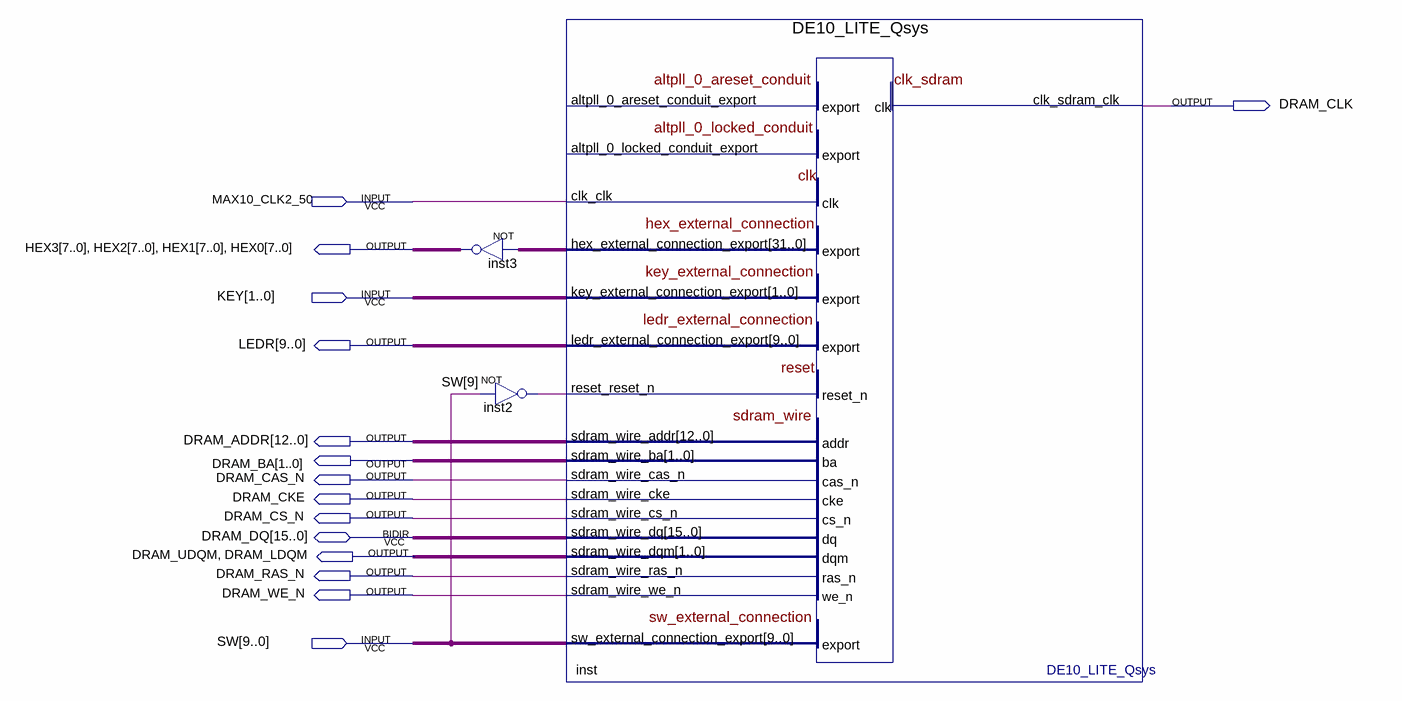
[diagram p0: schematic sheet]
// Quartus schematic DE10_LITE_Nios_0.bdf as structural Verilog: 3 symbols, 15 pins
module DE10_LITE_Nios_0 (
  input  MAX10_CLK2_50,
  input  [1:0] KEY,
  input  [9:0] SW,
  inout  [15:0] DRAM_DQ,
  output DRAM_CLK,
  output [7:0] HEX3,
  output [7:0] HEX2,
  output [7:0] HEX1,
  output [7:0] HEX0,
  output [9:0] LEDR,
  output [12:0] DRAM_ADDR,
  output [1:0] DRAM_BA,
  output DRAM_CAS_N,
  output DRAM_CKE,
  output DRAM_CS_N,
  output DRAM_UDQM,
  output DRAM_LDQM,
  output DRAM_RAS_N,
  output DRAM_WE_N
);

  wire inst2_out;
  wire [31:0] inst_hex_external_connection_export;

  assign {HEX3, HEX2, HEX1, HEX0} = ~inst_hex_external_connection_export;  // NOT inst3, 32 bits wide
  not inst2 (inst2_out, SW[9]);
  DE10_LITE_Qsys inst (
    .clk_clk(MAX10_CLK2_50), .key_external_connection_export(KEY), .reset_reset_n(inst2_out),
    .sw_external_connection_export(SW), .clk_sdram_clk(DRAM_CLK),
    .hex_external_connection_export(inst_hex_external_connection_export),
    .ledr_external_connection_export(LEDR), .sdram_wire_addr(DRAM_ADDR), .sdram_wire_ba(DRAM_BA),
    .sdram_wire_cas_n(DRAM_CAS_N), .sdram_wire_cke(DRAM_CKE), .sdram_wire_cs_n(DRAM_CS_N),
    .sdram_wire_dqm({DRAM_UDQM, DRAM_LDQM}), .sdram_wire_ras_n(DRAM_RAS_N), .sdram_wire_we_n(DRAM_WE_N),
    .sdram_wire_dq(DRAM_DQ));  // open: altpll_0_areset_conduit_export, altpll_0_locked_conduit_export
endmodule
